# Altium schematic sheet filter.SchDoc
size A3; PageSetup: Record=PageOptions|CenterHorizontal=True|CenterVertical=True|PrintScale=0.68|XCorrection=1.00|YCorrection=1.00|PrintKind=1|BorderSize=5000000|LeftOffset=0|BottomOffset=0|Orientation=2|PaperLength=1000|PaperWidth=1000|Scale=100|PaperSource=15|PrintQuality=600|MediaType=1|DitherType=10|PaperKind=Letter|PrintScaleMode=1
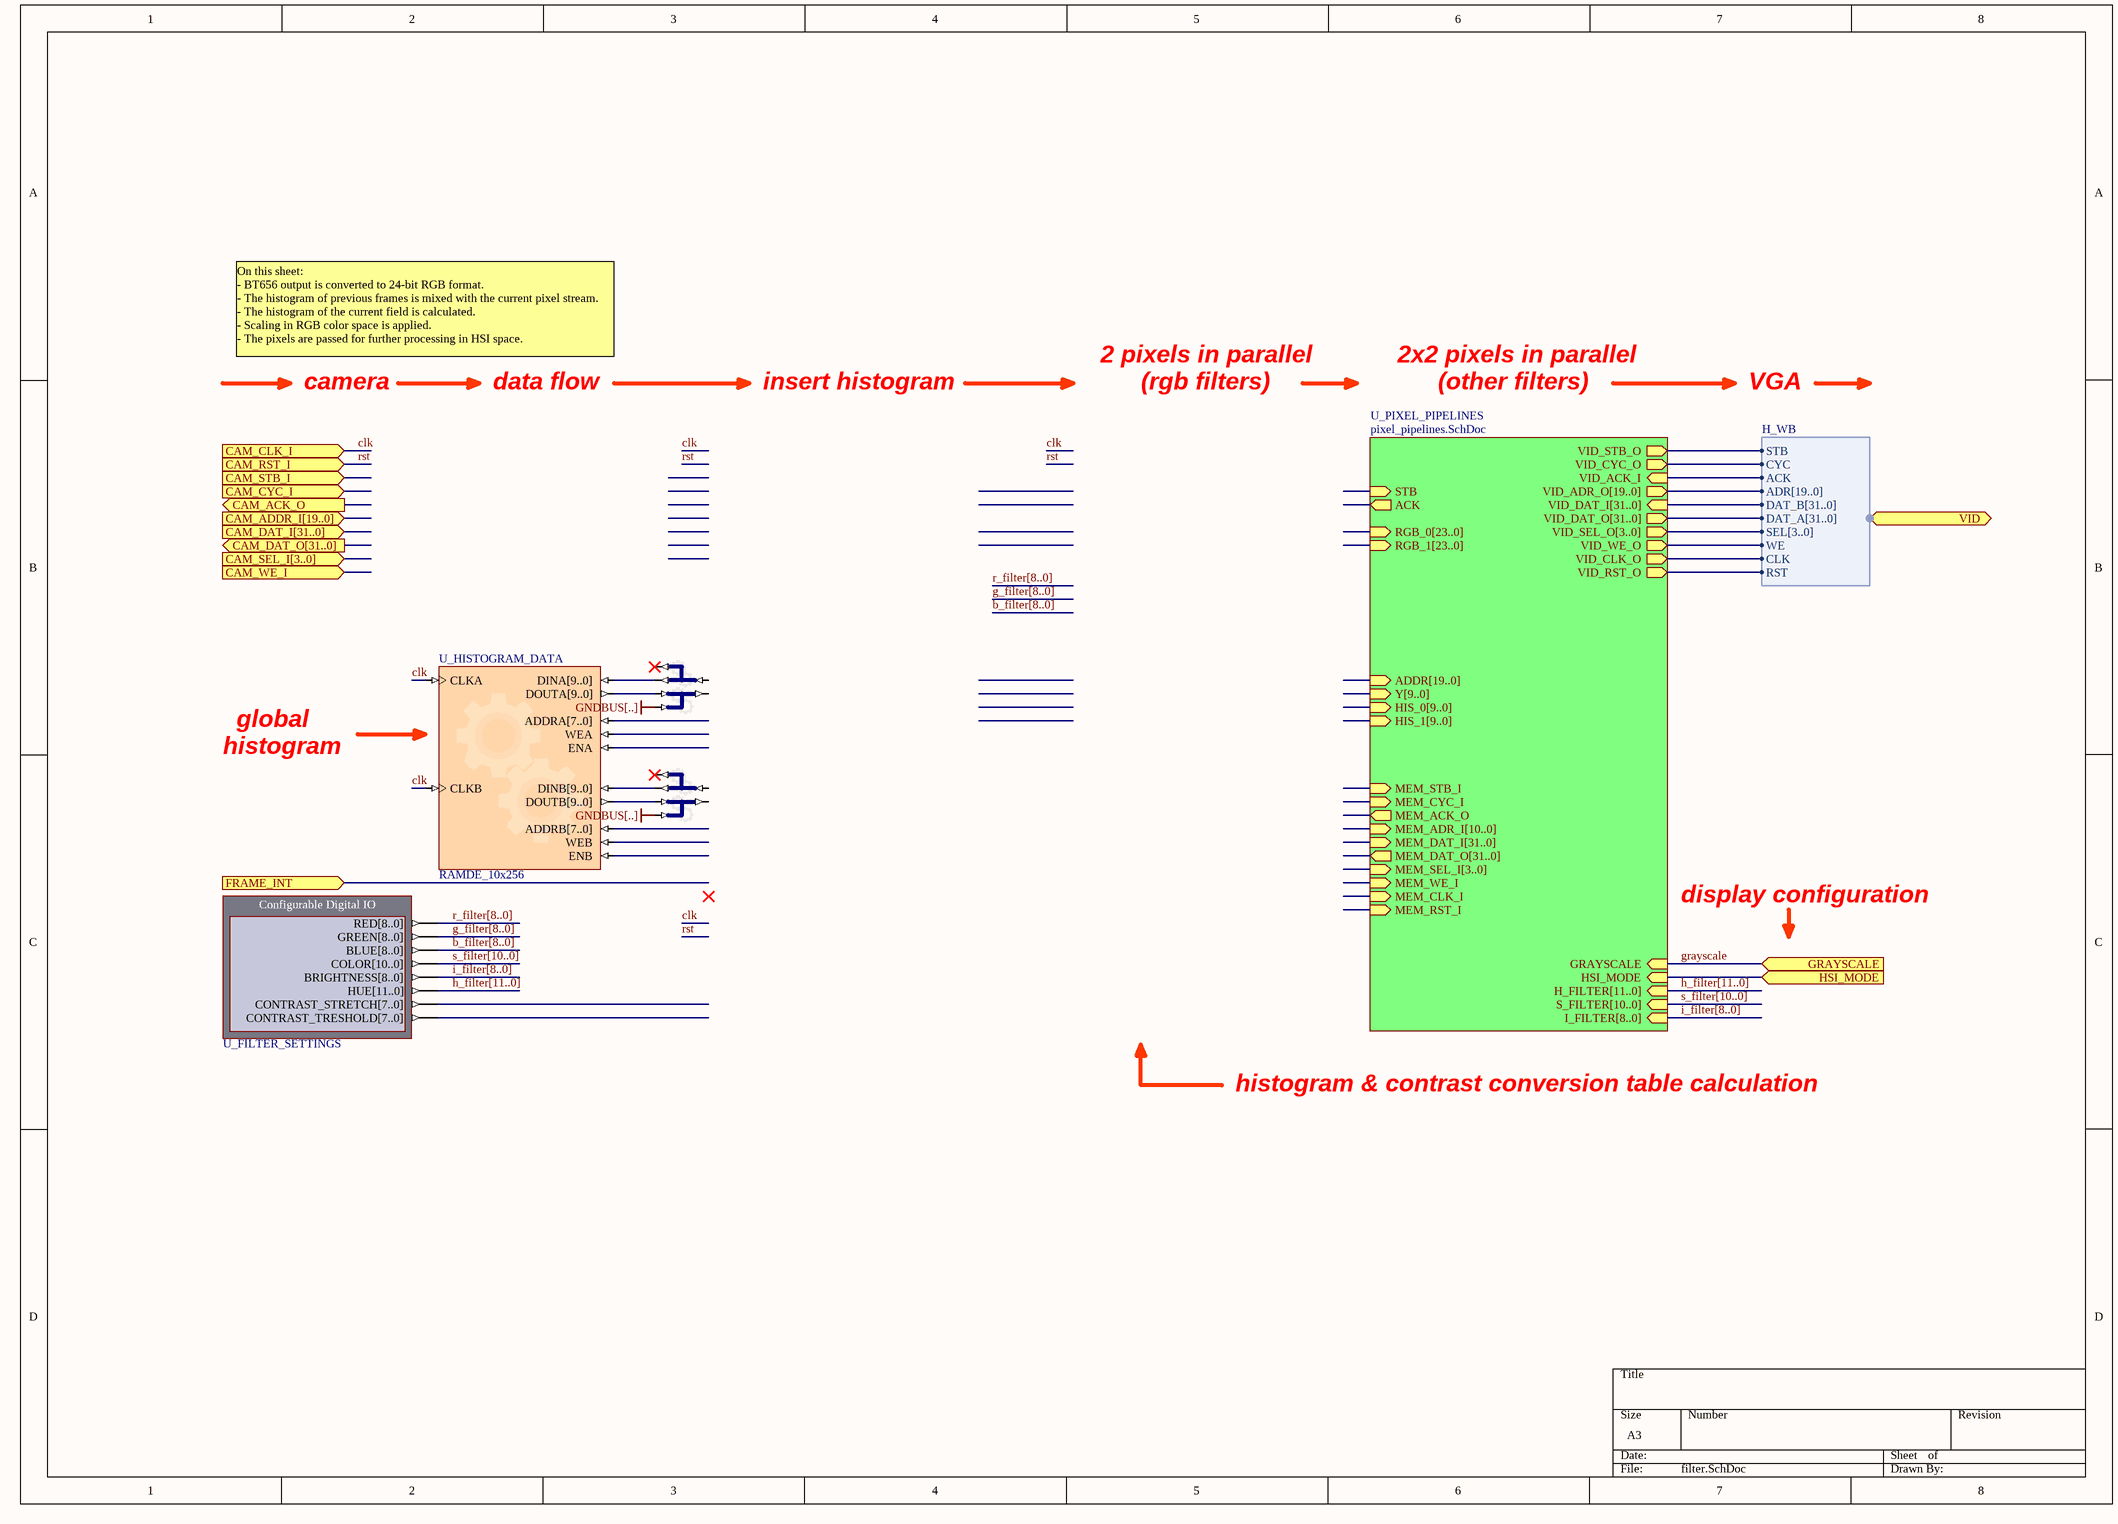
[diagram p0: filter.SchDoc]

## Parts
U2  BUS_JS  (value not drawn)
U22  BUS_JS  (value not drawn)
U24  BUS_JS  (value not drawn)
U30  BUS_JS  (value not drawn)
U_FILTER_SETTINGS  DIGITAL_IO  (value not drawn)
U_HISTOGRAM_DATA  RAMDE_10x256

## Sub-sheets
U_PIXEL_PIPELINES = pixel_pipelines.SchDoc: RGB_0[23..0] (in), HIS_0[9..0] (in), ADDR[19..0] (in), Y[9..0] (in), RGB_1[23..0] (in), HIS_1[9..0] (in), STB (in), ACK (out), MEM_STB_I (in), MEM_CYC_I (in), MEM_ACK_O (out), MEM_ADR_I[10..0] (in), MEM_DAT_I[31..0] (in), MEM_DAT_O[31..0] (out), MEM_SEL_I[3..0] (in), MEM_WE_I (in), MEM_CLK_I (in), MEM_RST_I (in), GRAYSCALE (in), HSI_MODE (in), S_FILTER[10..0] (in), I_FILTER[8..0] (in), H_FILTER[11..0] (in), VID_STB_O (out), VID_CYC_O (out), VID_ACK_I (in), VID_ADR_O[19..0] (out), VID_DAT_I[31..0] (in), VID_DAT_O[31..0] (out), VID_SEL_O[3..0] (out), VID_WE_O (out), VID_CLK_O (out), VID_RST_O (out)

## Ports
CAM_ACK_O (out), CAM_ADDR_I[19..0] (in), CAM_CLK_I (in), CAM_CYC_I (in), CAM_DAT_I[31..0] (in), CAM_DAT_O[31..0] (out), CAM_RST_I (in), CAM_SEL_I[3..0] (in), CAM_STB_I (in), CAM_WE_I (in), FRAME_INT (in), GRAYSCALE (in), HSI_MODE (in), VID (harness H_WB)

## Harnesses
H_WB: ADR[19..0], CLK, RST, CYC, STB, WE, DAT_B[31..0], ACK, SEL[3..0], DAT_A[31..0]

## Nets
GNDBUS[..]: U22.I1_B[5..0] U30.I1_B[5..0]
b_filter[8..0]: U_FILTER_SETTINGS.BLUE[8..0]
clk: U_HISTOGRAM_DATA.CLKA U_HISTOGRAM_DATA.CLKB ; port CAM_CLK_I
g_filter[8..0]: U_FILTER_SETTINGS.GREEN[8..0]
grayscale: port GRAYSCALE, sheet U_PIXEL_PIPELINES/GRAYSCALE
h_filter[11..0]: U_FILTER_SETTINGS.HUE[11..0] ; sheet U_PIXEL_PIPELINES/H_FILTER[11..0]
HSI_MODE: port HSI_MODE, sheet U_PIXEL_PIPELINES/HSI_MODE
i_filter[8..0]: U_FILTER_SETTINGS.BRIGHTNESS[8..0] ; sheet U_PIXEL_PIPELINES/I_FILTER[8..0]
r_filter[8..0]: U_FILTER_SETTINGS.RED[8..0]
rst: port CAM_RST_I
s_filter[10..0]: U_FILTER_SETTINGS.COLOR[10..0] ; sheet U_PIXEL_PIPELINES/S_FILTER[10..0]
NetU2_O0_B[9..0]: U2.O0_B[9..0] U_HISTOGRAM_DATA.DINA[9..0]
NetU22_I0_B[9..0]: U22.I0_B[9..0] U_HISTOGRAM_DATA.DOUTA[9..0]
NetU24_O0_B[9..0]: U24.O0_B[9..0] U_HISTOGRAM_DATA.DINB[9..0]
NetU30_I0_B[9..0]: U30.I0_B[9..0] U_HISTOGRAM_DATA.DOUTB[9..0]
(unnamed): sheet U_PIXEL_PIPELINES/VID_STB_O, port VID.STB
(unnamed): sheet U_PIXEL_PIPELINES/VID_CYC_O, port VID.CYC
(unnamed): sheet U_PIXEL_PIPELINES/VID_ACK_I, port VID.ACK
(unnamed): sheet U_PIXEL_PIPELINES/VID_WE_O, port VID.WE
(unnamed): sheet U_PIXEL_PIPELINES/VID_CLK_O, port VID.CLK
(unnamed): sheet U_PIXEL_PIPELINES/VID_RST_O, port VID.RST

Not connected (* = marked no-connect by the designer): U2 I[15..0] O1_B[5..0]*; U22 O[15..0]; U24 I[15..0] O1_B[5..0]*; U30 O[15..0]; U_FILTER_SETTINGS CONTRAST_STRETCH[7..0] CONTRAST_TRESHOLD[7..0]; U_HISTOGRAM_DATA ADDRA[7..0] ADDRB[7..0] ENA ENB WEA WEB

## Buses and harness runs
bus b_filter[8..0]
bus g_filter[8..0]
bus h_filter[11..0]
bus h_filter[11..0] = sheet U_PIXEL_PIPELINES/H_FILTER[11..0]
bus i_filter[8..0]
bus i_filter[8..0] = sheet U_PIXEL_PIPELINES/I_FILTER[8..0]
bus r_filter[8..0]
bus s_filter[10..0]
bus s_filter[10..0] = sheet U_PIXEL_PIPELINES/S_FILTER[10..0]

## Notes on the sheet
- On this sheet:
  - BT656 output is converted to 24-bit RGB format.
  - The histogram of previous frames is mixed with the current pixel stream.
  - The histogram of the current field is calculated.
  - Scaling in RGB color space is applied.
  - The pixels are passed for further processing in HSI space.
- 2 pixels in parallel
- 2x2 pixels in parallel
- camera
- data flow
- insert histogram
- (rgb filters)
- (other filters)
- VGA
- histogram
- global
- display configuration
- histogram & contrast conversion table calculation

## Library data of the parts
U2 U24 = BUS_JS: Configurable Bus Joiner/Splitter; ConfiguratorName: GENERIC_BUS_JS; ConfigurationParameters: {}Version[1.1]{}SplitterJoinerType[Splitter]{}SignalCount[2]{}SignalWidth0[10]{}GapBelow0[1000000]{}ConnectionType0[Pin]{}SignalWidth1[6]{}GapBelow1[1000000]{}ConnectionType1[Pin]{}ShowPinNames[False]{}; LastRevisionNo: 1.00.00; Published: 17-Sep-2008; Publisher: Altium Limited; HelpURL: https://wiki.altium.com/display/ADOH/Configurable+Generic+Library
U22 U30 = BUS_JS: Configurable Bus Joiner/Splitter; ConfiguratorName: GENERIC_BUS_JS; ConfigurationParameters: {}Version[1.1]{}SplitterJoinerType[Joiner]{}SignalCount[2]{}SignalWidth0[10]{}GapBelow0[1000000]{}ConnectionType0[Pin]{}SignalWidth1[6]{}GapBelow1[1000000]{}ConnectionType1[Pin]{}ShowPinNames[False]{}; LastRevisionNo: 1.00.00; Published: 17-Sep-2008; Publisher: Altium Limited; HelpURL: https://wiki.altium.com/display/ADOH/Configurable+Generic+Library
U_FILTER_SETTINGS = DIGITAL_IO: Configurable Digital IO; NEXUS_CORE: Instrument; NEXUS_JTAG_DEVICE: True; NEXUS_JTAG_ORDER: 0; ConfigurationParameters: {}Version[2.0]{}StorageType[3]{}InterfaceType[Parallel]{}SchCompWidth[140]{}NoInputs[ ]{}Output0Name[RED{1}8..0{2}]{}Output0Width[9]{}Output0InitValue[255]{}Output0Kind[Slider]{}Output1Name[GREEN{1}8..0{2}]{}Output1Width[9]{}Output1InitValue[255]{}Output1Kind[Slider]{}Output2Name[BLUE{1}8..0{2}]{}Output2Width[9]{}Output2InitValue[255]{}Output2Kind[Slider]{}Output3Name[COLOR{1}10..0{2}]{}Output3Width[11]{}Output3InitValue[1023]{}Output3Kind[Slider]{}Output4Name[BRIGHTNESS{1}8..0{2}]{}Output4Width[9]{}Output4InitValue[255]{}Output4Kind[Slider]{}Output5Name[HUE{1}11..0{2}]{}Output5Width[12]{}Output5InitValue[0]{}Output5Kind[Slider]{}Output6Name[CONTRAST_STRETCH{1}7..0{2}]{}Output6Width[8]{}Output6InitValue[0]{}Output6Kind[Slider]{}Output7Name[CONTRAST_TRESHOLD{1}7..0{2}]{}Output7Width[8]{}Output7InitValue[0]{}Output7Kind[Slider]{}Designator[U_FILTER_SETTINGS]{}InternalID[0]{}; ConfiguratorName: DIGITAL_IO; ComponentLink1Description: Core &Resource Usage; ComponentLink1URL: CR0134 FPGA Instrument Resource Usage.pdf; Core Revision: 1.00.00; HelpURL: CR0179 DIGITAL_IO Configurable Digital IO Module.pdf; LastRevisionNo: 1.00.00; Published: 28-Jun-2007; Publisher: Altium Limited; UseInDSF: True
U_HISTOGRAM_DATA = MEMORY: Configurable Memory; ConfiguratorName: GENERIC_MEMORY; ConfigurationParameters: {}Version[1.0]{}Option_MemoryDepthText[256]{}Option_MemoryWidth[10]{}Option_PortCount[1]{}Option_MemoryType[0]{}Option_ByteWrites[False]{}Option_RisingEdgeClock[True]{}Option_EnablePin[True]{}Option_ResetPin[False]{}Option_UseDistributed[False]{}Option_InitMemoryFlag[False]{}Option_MemoryFileName[ ]{}Option_MemoryFileEndiannessBig[True]{}Option_MemoryFileEndiannessLittle[False]{}; LastRevisionNo: 1.00.00; Published: 28-Oct-2008; Publisher: Altium Limited; HelpURL: https://wiki.altium.com/display/ADOH/Configurable+Generic+Library